# Altium schematic sheet Sheet6.SchDoc
size A4
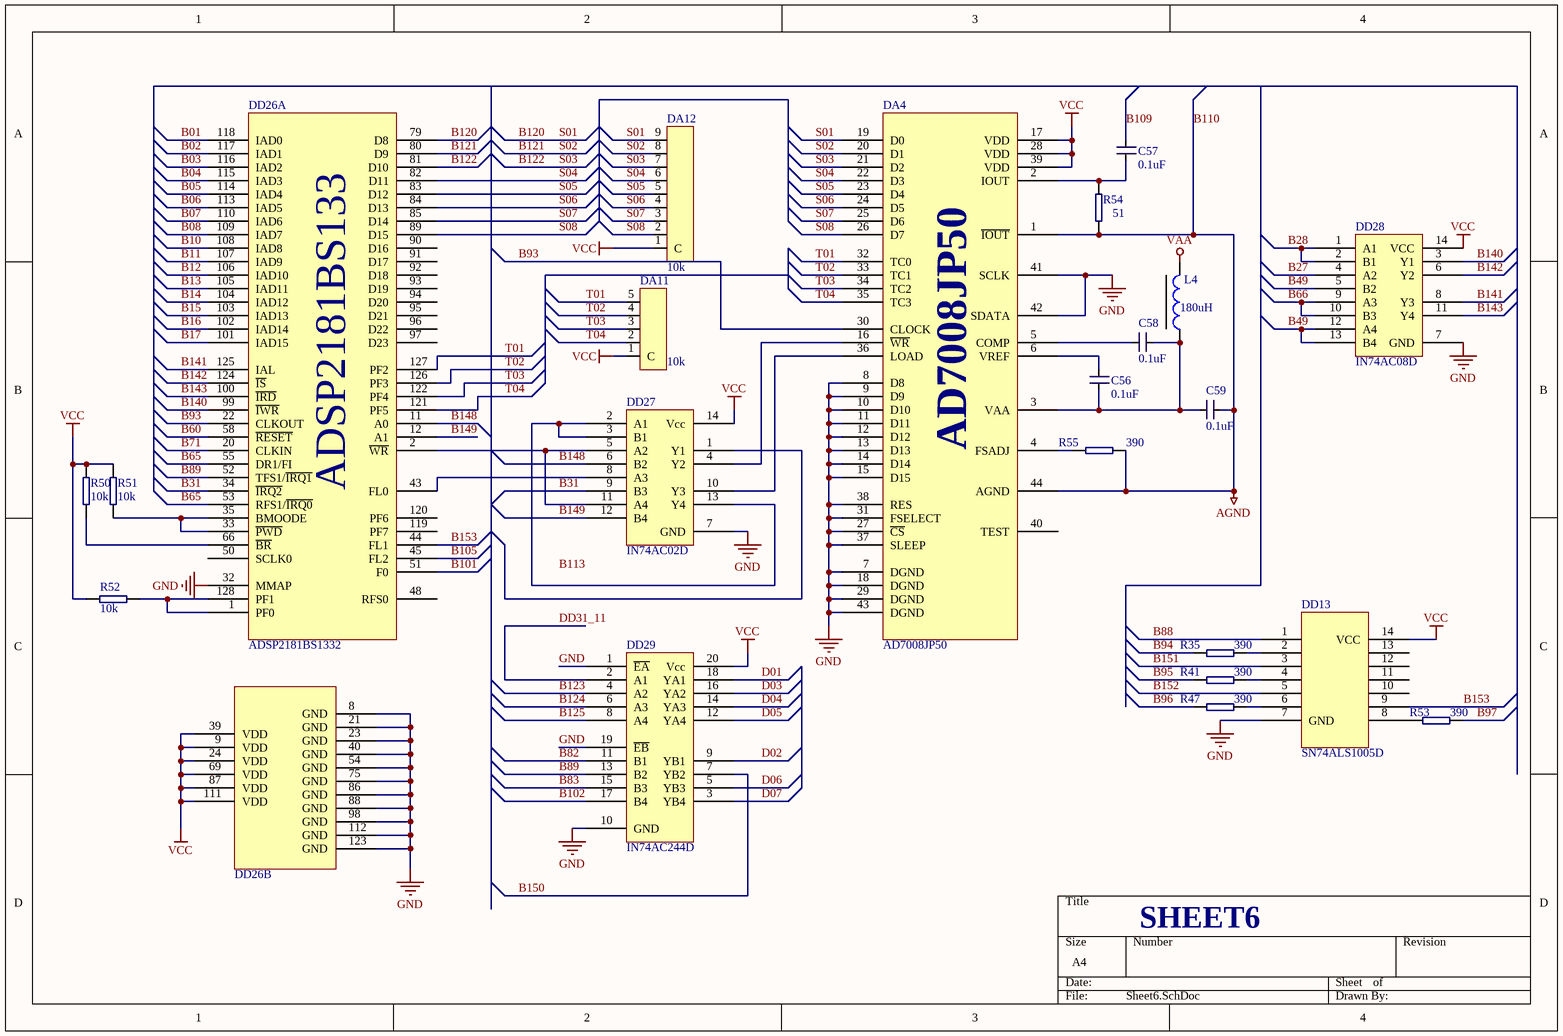
[diagram p0: Sheet6.SchDoc]

## Parts
C56  value 0.1uF  [0805]  (hidden comment: Cap)
C57  value 0.1uF  [0805]  (hidden comment: Cap)
C58  value 0.1uF  [0805]  (hidden comment: Cap)
C59  value 0.1uF  [0805]  (hidden comment: Cap)
DA4  AD7008JP50  [44 PLCC]
DA11  value 10k  [5 SIP]  (hidden comment: 5A103J)
DA12  value 10k  [9 SIP]  (hidden comment: 9A103J)
DD13  SN74ALS1005D  [14 SOIC-3.9]
DD26  ADSP2181BS1332  [128 PQFP]  (parts A,B of 2)
DD27  IN74AC02D  [14 SOIC-3.9]
DD28  IN74AC08D  [14 TSSOP-4.4]
DD29  IN74AC244D  [20 SOIC-7.5]
L4  value 180uH  [E(1820)]  (hidden comment: L)
R35  value 390  [0805]  (hidden comment: R)
R41  value 390  [0805]  (hidden comment: R)
R47  value 390  [0805]  (hidden comment: R)
R50  value 10k  [0805]  (hidden comment: R)
R51  value 10k  [0805]  (hidden comment: R)
R52  value 10k  [0805]  (hidden comment: R)
R53  value 390  [0805]  (hidden comment: R)
R54  value 51  [0805]  (hidden comment: R)
R55  value 390  [0805]  (hidden comment: R)

## Nets
B110: C59.1 DA4.1(~{IOUT}) DA4.44(AGND) R54.1 R55.2  [also labelled AGND]
GND: DA4.7(DGND) DA4.8(D8) DA4.9(D9) DA4.10(D10) DA4.11(D11) DA4.12(D12) DA4.13(D13) DA4.14(D14) DA4.15(D15) DA4.18(DGND) DA4.27(~{CS}) DA4.29(DGND) DA4.31(FSELECT) DA4.37(SLEEP) DA4.38(RES) DA4.41(SCLK) DA4.42(SDATA) DA4.43(DGND) DD13.7(GND) DD26.8(GND) DD26.21(GND) DD26.23(GND) DD26.32(MMAP) DD26.40(GND) DD26.54(GND) DD26.75(GND) DD26.86(GND) DD26.88(GND) DD26.98(GND) DD26.112(GND) DD26.123(GND) DD27.7(GND) DD28.7(GND) DD29.1(~{EA}) DD29.10(GND) DD29.19(~{EB})
VAA: L4.2
VCC: DA4.17(VDD) DA4.28(VDD) DA4.39(VDD) DA11.1(C) DA12.1(C) DD13.14(VCC) DD26.9(VDD) DD26.24(VDD) DD26.39(VDD) DD26.69(VDD) DD26.87(VDD) DD26.111(VDD) DD27.14(Vcc) DD28.14(VCC) DD29.20(Vcc) R50.2 R51.2 R52.2
B01: DD26.118(IAD0)
B02: DD26.117(IAD1)
B03: DD26.116(IAD2)
B04: DD26.115(IAD3)
B05: DD26.114(IAD4)
B06: DD26.113(IAD5)
B07: DD26.110(IAD6)
B08: DD26.109(IAD7)
B10: DD26.108(IAD8)
B11: DD26.107(IAD9)
B12: DD26.106(IAD10)
B13: DD26.105(IAD11)
B14: DD26.104(IAD12)
B15: DD26.103(IAD13)
B16: DD26.102(IAD14)
B17: DD26.101(IAD15)
B27: DD28.4(A2)
B28: DD28.1(A1) DD28.2(B1)
B31: DD26.34(~{IRQ2}) DD27.9(B3)
B49: DD28.5(B2) DD28.12(A4) DD28.13(B4)
B60: DD26.58(~{RESET})
B65: DD26.53(RFS1/~{IRQ0}) DD26.55(DR1/FI)
B66: DD28.9(A3) DD28.10(B3)
B71: DD26.20(CLKIN)
B82: DD29.11(B1)
B83: DD29.15(B3)
B88: DD13.1
B89: DD26.52(TFS1/~{IRQ1}) DD29.13(B2)
B93: DA4.30(CLOCK) DD26.22(CLKOUT)
B94: R35.2
B95: R41.2
B96: R47.2
B97: R53.1
B101: DD26.51(F0)
B102: DD29.17(B4)
B105: DD26.45(FL2)
B109: C57.2
B120: DA4.19(D0) DA12.9 DD26.79(D8)  [also labelled S01]
B121: DA4.20(D1) DA12.8 DD26.80(D9)  [also labelled S02]
B122: DA4.21(D2) DA12.7 DD26.81(D10)  [also labelled S03]
B123: DD29.4(A2)
B124: DD29.6(A3)
B125: DD29.8(A4)
B140: DD26.99(~{IWR}) DD28.3(Y1)
B141: DD26.125(IAL) DD28.8(Y3)
B142: DD26.124(~{IS}) DD28.6(Y2)
B143: DD26.100(~{IRD}) DD28.11(Y4)
B148: DD26.11(A0) DD27.6(B2)
B149: DD26.12(A1) DD27.12(B4)
B150: DD29.7(YB2)
B151: DD13.3
B152: DD13.5
B153: DD13.9 DD26.44(FL1)
D01: DD29.18(YA1)
D02: DD29.9(YB1)
D03: DD29.16(YA2)
D04: DD29.14(YA3)
D05: DD29.12(YA4)
D06: DD29.5(YB3)
D07: DD29.3(YB4)
DD31_11: DD29.2(A1)
S04: DA4.22(D3) DA12.6 DD26.82(D11)
S05: DA4.23(D4) DA12.5 DD26.83(D12)
S06: DA4.24(D5) DA12.4 DD26.84(D13)
S07: DA4.25(D6) DA12.3 DD26.85(D14)
S08: DA4.26(D7) DA12.2 DD26.89(D15)
T01: DA4.32(TC0) DA11.5 DD26.127(PF2)
T02: DA4.33(TC1) DA11.4 DD26.126(PF3)
T03: DA4.34(TC2) DA11.3 DD26.122(PF4)
T04: DA4.35(TC3) DA11.2 DD26.121(PF5)
NetC56_1: C56.1 C58.1 C59.2 DA4.3(VAA) L4.1
NetC56_2: C56.2 DA4.6(VREF)
NetC57_1: C57.1 DA4.2(IOUT) R54.2
NetC58_2: C58.2 DA4.5(COMP)
NetDA4_4: DA4.4(FSADJ) R55.1
NetDA4_16: DA4.16(~{WR}) DD27.4(Y2)
NetDA4_36: DA4.36(LOAD) DD27.10(Y3)
NetDD13_2: DD13.2 R35.1
NetDD13_4: DD13.4 R41.1
NetDD13_6: DD13.6 R47.1
NetDD13_8: DD13.8 R53.2
NetDD26_1: DD26.1(PF0) DD26.128(PF1) R52.1
NetDD26_2: DD26.2(~{WR}) DD27.5(A2) DD27.11(A4)
NetDD26_33: DD26.33(~{PWD}) DD26.35(BMOODE) R51.1
NetDD26_43: DD26.43(FL0) DD27.8(A3)
NetDD26_66: DD26.66(~{BR}) R50.1
NetDD27_2: DD27.2(A1) DD27.3(B1) DD27.13(Y4)

Not connected (* = marked no-connect by the designer): DA4 40(TEST); DD13 10 11 12 13; DD26 48(RFS0) 50(SCLK0) 90(D16) 91(D17) 92(D18) 93(D19) 94(D20) 95(D21) 96(D22) 97(D23) 119(PF7) 120(PF6); DD27 1(Y1)

## Notes on the sheet
- SHEET6
- Labels drawn without touching a wire or pin: B113
- (in symbol ADSP2181BS1332, part A) ADSP2181BS133